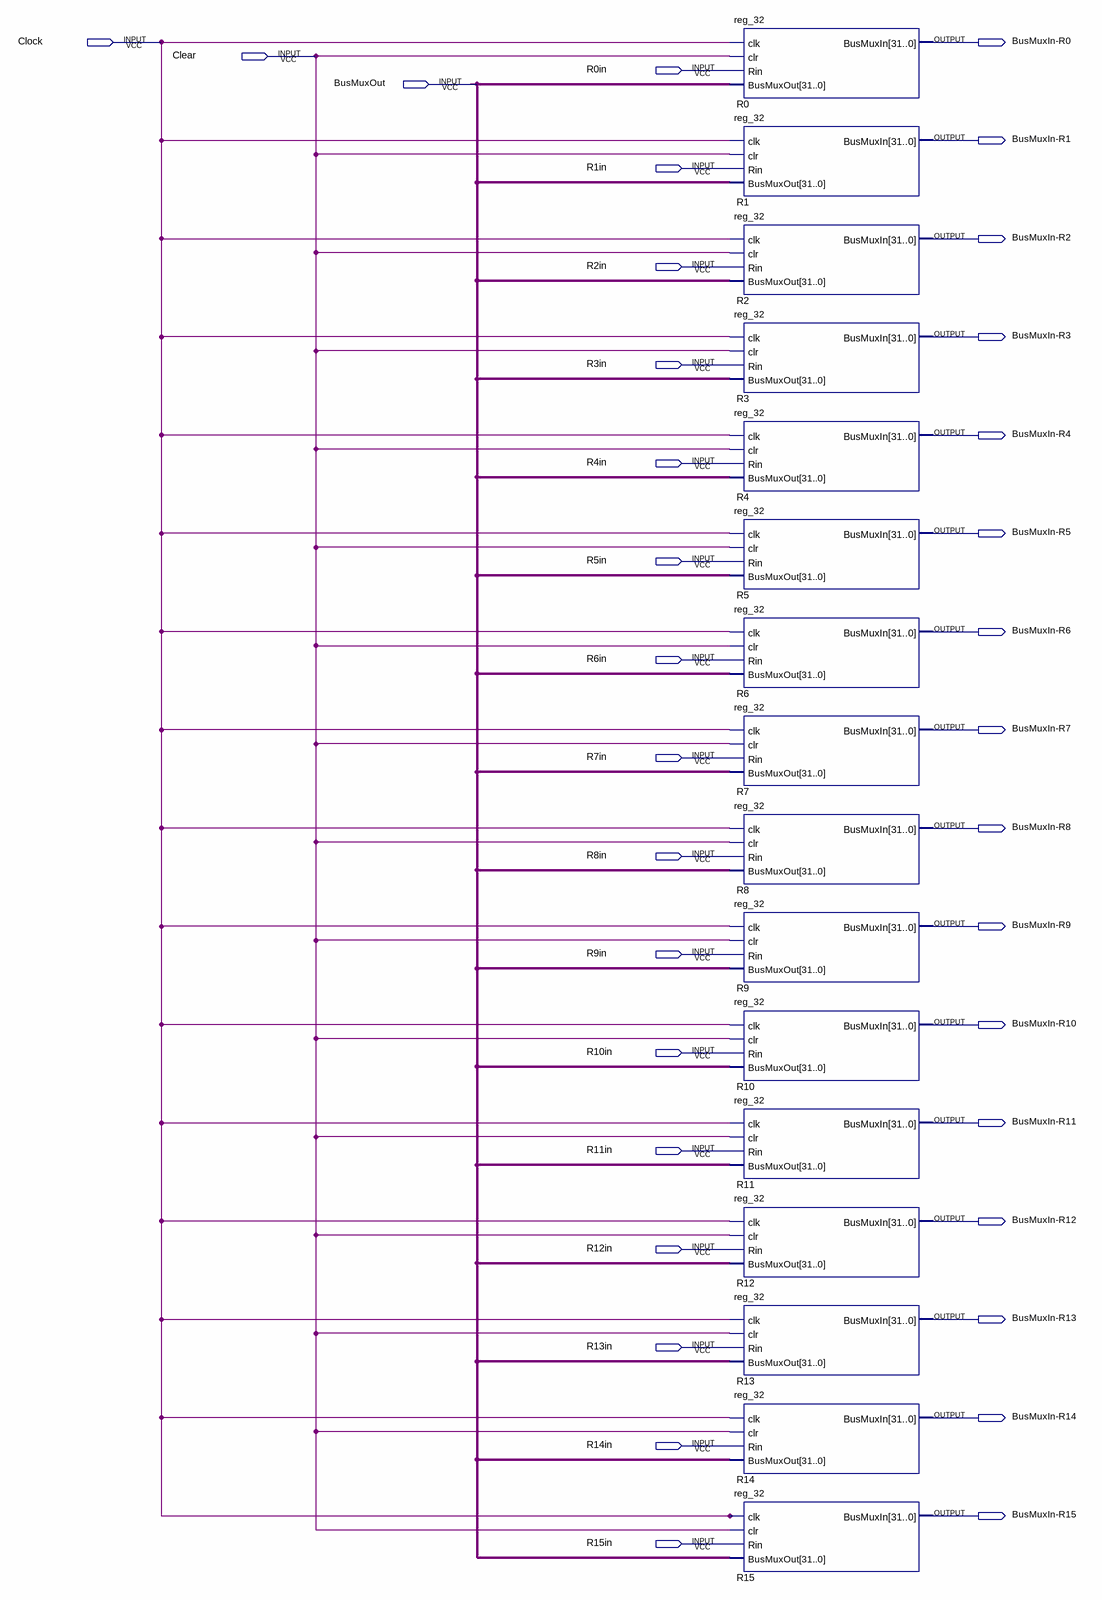
[diagram p0: schematic sheet]
// Quartus schematic registerFile.bdf as structural Verilog: 16 symbols, 35 pins
module registerFile (
  input  Clock,
  input  Clear,
  input  R0in,
  input  BusMuxOut,
  input  R1in,
  input  R2in,
  input  R3in,
  input  R4in,
  input  R5in,
  input  R6in,
  input  R7in,
  input  R8in,
  input  R9in,
  input  R10in,
  input  R11in,
  input  R12in,
  input  R13in,
  input  R14in,
  input  R15in,
  output \BusMuxIn-R0 ,
  output \BusMuxIn-R1 ,
  output \BusMuxIn-R2 ,
  output \BusMuxIn-R3 ,
  output \BusMuxIn-R4 ,
  output \BusMuxIn-R5 ,
  output \BusMuxIn-R6 ,
  output \BusMuxIn-R7 ,
  output \BusMuxIn-R8 ,
  output \BusMuxIn-R9 ,
  output \BusMuxIn-R10 ,
  output \BusMuxIn-R11 ,
  output \BusMuxIn-R12 ,
  output \BusMuxIn-R13 ,
  output \BusMuxIn-R14 ,
  output \BusMuxIn-R15 
);

  wire [31:0] undriven;

  reg_32 R0 (.clk(Clock), .clr(Clear), .Rin(R0in), .BusMuxOut(undriven), .BusMuxIn(\BusMuxIn-R0 ));
  reg_32 R1 (.clk(Clock), .clr(Clear), .Rin(R1in), .BusMuxOut(undriven), .BusMuxIn(\BusMuxIn-R1 ));
  reg_32 R2 (.clk(Clock), .clr(Clear), .Rin(R2in), .BusMuxOut(undriven), .BusMuxIn(\BusMuxIn-R2 ));
  reg_32 R3 (.clk(Clock), .clr(Clear), .Rin(R3in), .BusMuxOut(undriven), .BusMuxIn(\BusMuxIn-R3 ));
  reg_32 R4 (.clk(Clock), .clr(Clear), .Rin(R4in), .BusMuxOut(undriven), .BusMuxIn(\BusMuxIn-R4 ));
  reg_32 R5 (.clk(Clock), .clr(Clear), .Rin(R5in), .BusMuxOut(undriven), .BusMuxIn(\BusMuxIn-R5 ));
  reg_32 R6 (.clk(Clock), .clr(Clear), .Rin(R6in), .BusMuxOut(undriven), .BusMuxIn(\BusMuxIn-R6 ));
  reg_32 R7 (.clk(Clock), .clr(Clear), .Rin(R7in), .BusMuxOut(undriven), .BusMuxIn(\BusMuxIn-R7 ));
  reg_32 R8 (.clk(Clock), .clr(Clear), .Rin(R8in), .BusMuxOut(undriven), .BusMuxIn(\BusMuxIn-R8 ));
  reg_32 R9 (.clk(Clock), .clr(Clear), .Rin(R9in), .BusMuxOut(undriven), .BusMuxIn(\BusMuxIn-R9 ));
  reg_32 R10 (.clk(Clock), .clr(Clear), .Rin(R10in), .BusMuxOut(undriven), .BusMuxIn(\BusMuxIn-R10 ));
  reg_32 R11 (.clk(Clock), .clr(Clear), .Rin(R11in), .BusMuxOut(undriven), .BusMuxIn(\BusMuxIn-R11 ));
  reg_32 R12 (.clk(Clock), .clr(Clear), .Rin(R12in), .BusMuxOut(undriven), .BusMuxIn(\BusMuxIn-R12 ));
  reg_32 R13 (.clk(Clock), .clr(Clear), .Rin(R13in), .BusMuxOut(undriven), .BusMuxIn(\BusMuxIn-R13 ));
  reg_32 R14 (.clk(Clock), .clr(Clear), .Rin(R14in), .BusMuxOut(undriven), .BusMuxIn(\BusMuxIn-R14 ));
  reg_32 R15 (.clk(Clock), .clr(Clear), .Rin(R15in), .BusMuxOut(undriven), .BusMuxIn(\BusMuxIn-R15 ));
endmodule
